# Altium schematic sheet SH2-CONTROLS.SchDoc: SH2-CONTROLS
size Letter; DrawnBy: Qinyang Bao; SheetNumber: 2; SheetTotal: 4
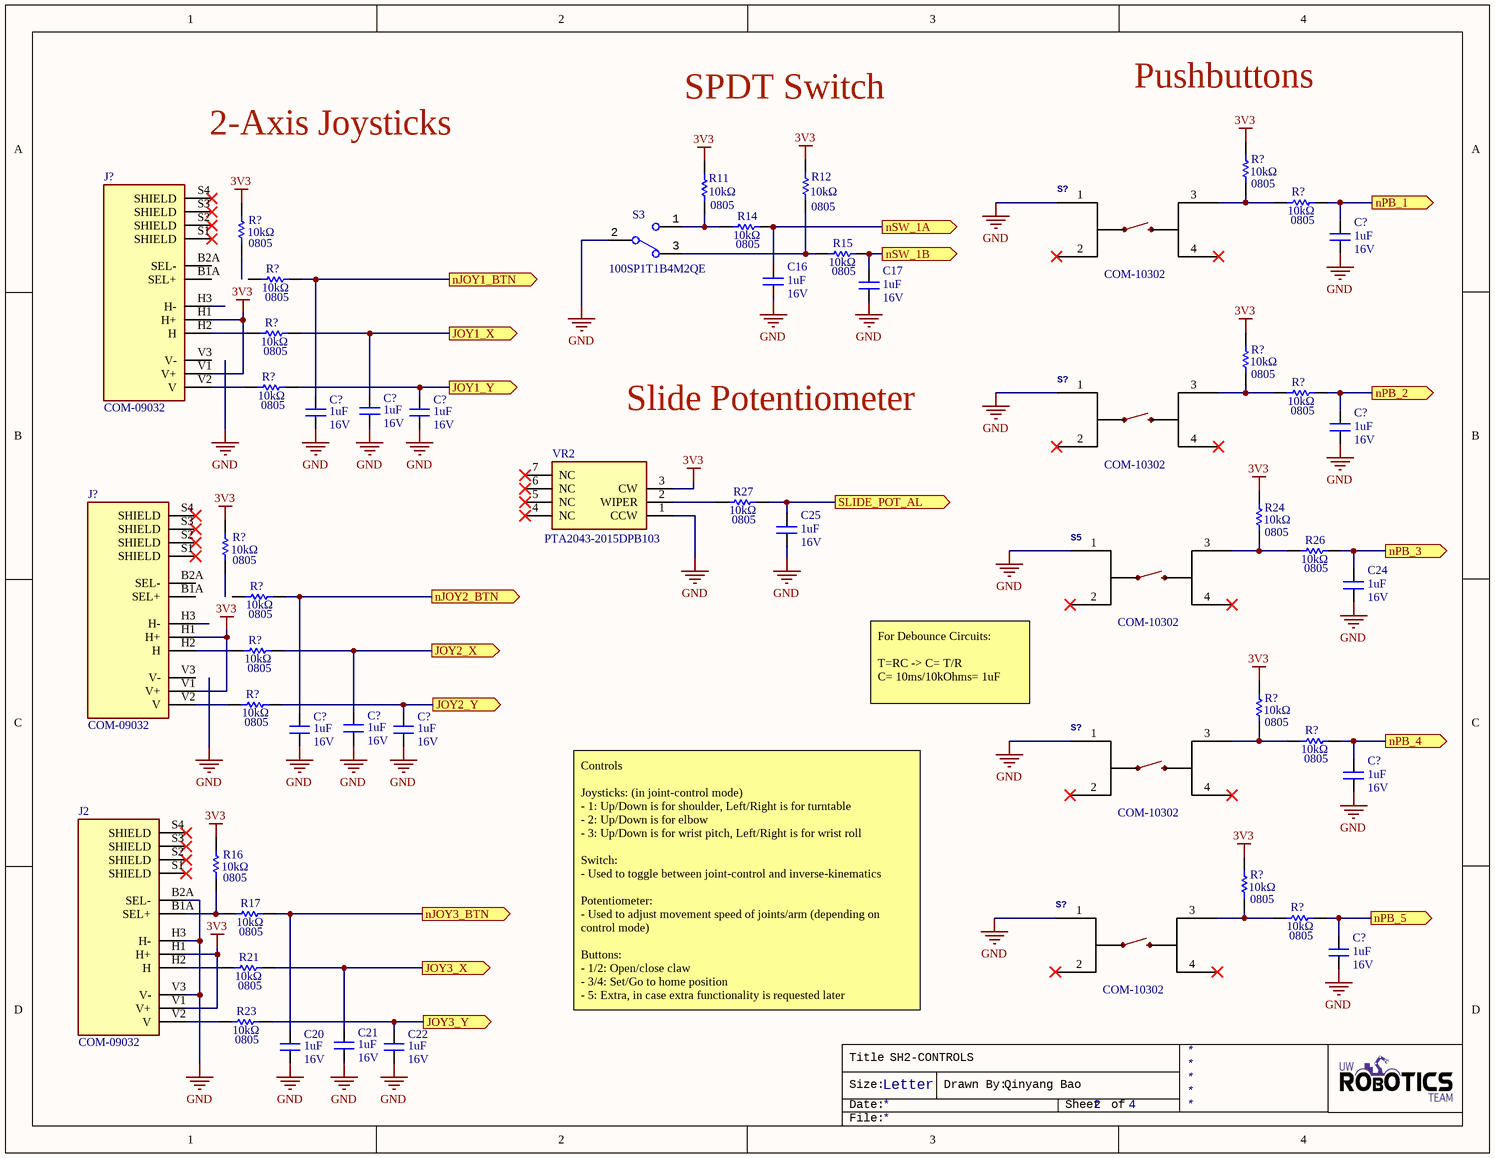
[diagram p0: SH2-CONTROLS.SchDoc]

## Parts
(Parts that share a designator on the sheet are numbered #1, #2 ... from top to bottom, then left to right.)
C16  value 1uF  Voltage Rating: 16V  [CAPC2012X140N]  (hidden comment: CAP_1uF_16V_0805)
C17  value 1uF  Voltage Rating: 16V  [CAPC2012X140N]  (hidden comment: CAP_1uF_16V_0805)
C20  value 1uF  Voltage Rating: 16V  [CAPC2012X140N]  (hidden comment: CAP_1uF_16V_0805)
C21  value 1uF  Voltage Rating: 16V  [CAPC2012X140N]  (hidden comment: CAP_1uF_16V_0805)
C22  value 1uF  Voltage Rating: 16V  [CAPC2012X140N]  (hidden comment: CAP_1uF_16V_0805)
C24  value 1uF  Voltage Rating: 16V  [CAPC2012X140N]  (hidden comment: CAP_1uF_16V_0805)
C25  value 1uF  Voltage Rating: 16V  [CAPC2012X140N]  (hidden comment: CAP_1uF_16V_0805)
C?#1  value 1uF  Voltage Rating: 16V  [CAPC2012X140N]  (hidden comment: CAP_1uF_16V_0805)
C?#2  value 1uF  Voltage Rating: 16V  [CAPC2012X140N]  (hidden comment: CAP_1uF_16V_0805)
C?#3  value 1uF  Voltage Rating: 16V  [CAPC2012X140N]  (hidden comment: CAP_1uF_16V_0805)
C?#4  value 1uF  Voltage Rating: 16V  [CAPC2012X140N]  (hidden comment: CAP_1uF_16V_0805)
C?#5  value 1uF  Voltage Rating: 16V  [CAPC2012X140N]  (hidden comment: CAP_1uF_16V_0805)
C?#6  value 1uF  Voltage Rating: 16V  [CAPC2012X140N]  (hidden comment: CAP_1uF_16V_0805)
C?#7  value 1uF  Voltage Rating: 16V  [CAPC2012X140N]  (hidden comment: CAP_1uF_16V_0805)
C?#8  value 1uF  Voltage Rating: 16V  [CAPC2012X140N]  (hidden comment: CAP_1uF_16V_0805)
C?#9  value 1uF  Voltage Rating: 16V  [CAPC2012X140N]  (hidden comment: CAP_1uF_16V_0805)
C?#10  value 1uF  Voltage Rating: 16V  [CAPC2012X140N]  (hidden comment: CAP_1uF_16V_0805)
J2  Manufacturer Part Number 1: COM-09032  [2_AXIS_JOY]  (hidden comment: 2_AXIS_JOYSTICK)
J?#1  Manufacturer Part Number 1: COM-09032  [2_AXIS_JOY]  (hidden comment: 2_AXIS_JOYSTICK)
J?#2  Manufacturer Part Number 1: COM-09032  [2_AXIS_JOY]  (hidden comment: 2_AXIS_JOYSTICK)
R11  value 10kΩ  Case Code (Imperial): 0805  [RESC2012X60N]  (hidden comment: RES_10kΩ_0805)
R12  value 10kΩ  Case Code (Imperial): 0805  [RESC2012X60N]  (hidden comment: RES_10kΩ_0805)
R14  value 10kΩ  Case Code (Imperial): 0805  [RESC2012X60N]  (hidden comment: RES_10kΩ_0805)
R15  value 10kΩ  Case Code (Imperial): 0805  [RESC2012X60N]  (hidden comment: RES_10kΩ_0805)
R16  value 10kΩ  Case Code (Imperial): 0805  [RESC2012X60N]  (hidden comment: RES_10kΩ_0805)
R17  value 10kΩ  Case Code (Imperial): 0805  [RESC2012X60N]  (hidden comment: RES_10kΩ_0805)
R21  value 10kΩ  Case Code (Imperial): 0805  [RESC2012X60N]  (hidden comment: RES_10kΩ_0805)
R23  value 10kΩ  Case Code (Imperial): 0805  [RESC2012X60N]  (hidden comment: RES_10kΩ_0805)
R24  value 10kΩ  Case Code (Imperial): 0805  [RESC2012X60N]  (hidden comment: RES_10kΩ_0805)
R26  value 10kΩ  Case Code (Imperial): 0805  [RESC2012X60N]  (hidden comment: RES_10kΩ_0805)
R27  value 10kΩ  Case Code (Imperial): 0805  [RESC2012X60N]  (hidden comment: RES_10kΩ_0805)
R?#1  value 10kΩ  Case Code (Imperial): 0805  [RESC2012X60N]  (hidden comment: RES_10kΩ_0805)
R?#2  value 10kΩ  Case Code (Imperial): 0805  [RESC2012X60N]  (hidden comment: RES_10kΩ_0805)
R?#3  value 10kΩ  Case Code (Imperial): 0805  [RESC2012X60N]  (hidden comment: RES_10kΩ_0805)
R?#4  value 10kΩ  Case Code (Imperial): 0805  [RESC2012X60N]  (hidden comment: RES_10kΩ_0805)
R?#5  value 10kΩ  Case Code (Imperial): 0805  [RESC2012X60N]  (hidden comment: RES_10kΩ_0805)
R?#6  value 10kΩ  Case Code (Imperial): 0805  [RESC2012X60N]  (hidden comment: RES_10kΩ_0805)
R?#7  value 10kΩ  Case Code (Imperial): 0805  [RESC2012X60N]  (hidden comment: RES_10kΩ_0805)
R?#8  value 10kΩ  Case Code (Imperial): 0805  [RESC2012X60N]  (hidden comment: RES_10kΩ_0805)
R?#9  value 10kΩ  Case Code (Imperial): 0805  [RESC2012X60N]  (hidden comment: RES_10kΩ_0805)
R?#10  value 10kΩ  Case Code (Imperial): 0805  [RESC2012X60N]  (hidden comment: RES_10kΩ_0805)
R?#11  value 10kΩ  Case Code (Imperial): 0805  [RESC2012X60N]  (hidden comment: RES_10kΩ_0805)
R?#12  value 10kΩ  Case Code (Imperial): 0805  [RESC2012X60N]  (hidden comment: RES_10kΩ_0805)
R?#13  value 10kΩ  Case Code (Imperial): 0805  [RESC2012X60N]  (hidden comment: RES_10kΩ_0805)
R?#14  value 10kΩ  Case Code (Imperial): 0805  [RESC2012X60N]  (hidden comment: RES_10kΩ_0805)
R?#15  value 10kΩ  Case Code (Imperial): 0805  [RESC2012X60N]  (hidden comment: RES_10kΩ_0805)
R?#16  value 10kΩ  Case Code (Imperial): 0805  [RESC2012X60N]  (hidden comment: RES_10kΩ_0805)
S3  SW_SPDT  [100SP1T1B4M2QE]  (value not drawn)
S5  Manufacturer Part Number 1: COM-10302  [TACTILE_SWITCH_PTH_12MM]  (hidden comment: Pushbutton)
S?#1  Manufacturer Part Number 1: COM-10302  [TACTILE_SWITCH_PTH_12MM]  (hidden comment: Pushbutton)
S?#2  Manufacturer Part Number 1: COM-10302  [TACTILE_SWITCH_PTH_12MM]  (hidden comment: Pushbutton)
S?#3  Manufacturer Part Number 1: COM-10302  [TACTILE_SWITCH_PTH_12MM]  (hidden comment: Pushbutton)
S?#4  Manufacturer Part Number 1: COM-10302  [TACTILE_SWITCH_PTH_12MM]  (hidden comment: Pushbutton)
VR2  Manufacturer Part Number 1: PTA2043-2015DPB103  [PTA20432015CPB103]  (hidden comment: POT_10K_SLIDE)

## Ports
JOY1_X (out), JOY1_Y (out), JOY2_X (out), JOY2_Y (out), JOY3_X (out), JOY3_Y (out), nJOY1_BTN (out), nJOY2_BTN (out), nJOY3_BTN (out), nPB_1 (out), nPB_2 (out), nPB_3 (out), nPB_4 (out), nPB_5 (out), nSW_1A (out), nSW_1B (out), SLIDE_POT_AL (out)

## Nets
3V3: J2.H1(H+) J2.V1(V+) J?#1.H1(H+) J?#1.V1(V+) J?#2.H1(H+) J?#2.V1(V+) R11.1 R12.1 R16.1 R24.1 R?#1.1 R?#3.1 R?#6.1 R?#9.1 R?#13.1 R?#15.1 VR2.3(CW)
GND: C16.1 C17.1 C20.1 C21.1 C22.1 C24.1 C25.1 C?#1.1 C?#2.1 C?#3.1 C?#4.1 C?#5.1 C?#6.1 C?#7.1 C?#8.1 C?#9.1 C?#10.1 J2.B2A(SEL-) J2.H3(H-) J2.V3(V-) S3.2 S5.1 S?#1.1 S?#2.1 S?#3.1 S?#4.1 VR2.1(CCW)
JOY1_X: C?#3.2 R?#5.2 ; port JOY1_X
JOY1_Y: C?#4.2 R?#7.2 ; port JOY1_Y
JOY2_X: C?#7.2 R?#11.2 ; port JOY2_X
JOY2_Y: C?#8.2 R?#12.2 ; port JOY2_Y
JOY3_X: C21.2 R21.2 ; port JOY3_X
JOY3_Y: C22.2 R23.2 ; port JOY3_Y
nJOY1_BTN: C?#2.2 R?#4.2 ; port nJOY1_BTN
nJOY2_BTN: C?#6.2 R?#10.2 ; port nJOY2_BTN
nJOY3_BTN: C20.2 R17.2 ; port nJOY3_BTN
nPB_1: C?#1.2 R?#2.2 ; port nPB_1
nPB_2: C?#5.2 R?#8.2 ; port nPB_2
nPB_3: C24.2 R26.2 ; port nPB_3
nPB_4: C?#9.2 R?#14.2 ; port nPB_4
nPB_5: C?#10.2 R?#16.2 ; port nPB_5
nSW_1A: C16.2 R14.2 ; port nSW_1A
nSW_1B: C17.2 R15.2 ; port nSW_1B
SLIDE_POT_AL: C25.2 R27.2 ; port SLIDE_POT_AL
NetJ2_B1A: J2.B1A(SEL+) R16.2 R17.1
NetJ2_H2: J2.H2(H) R21.1
NetJ2_V2: J2.V2(V) R23.1
NetJ?#1_H2: J?#1.H2(H) R?#5.1
NetJ?#1_V2: J?#1.V2(V) R?#7.1
NetJ?#2_H2: J?#2.H2(H) R?#11.1
NetJ?#2_V2: J?#2.V2(V) R?#12.1
NetR11_2: R11.2 R14.1 S3.1
NetR12_2: R12.2 R15.1 S3.3
NetR24_2: R24.2 R26.1 S5.3
NetR27_1: R27.1 VR2.2(WIPER)
NetR?#1_2: R?#1.2 R?#2.1 S?#1.3
NetR?#6_2: R?#6.2 R?#8.1 S?#2.3
NetR?#13_2: R?#13.2 R?#14.1 S?#3.3
NetR?#15_2: R?#15.2 R?#16.1 S?#4.3

Not connected (* = marked no-connect by the designer): J2 S1(SHIELD)* S2(SHIELD)* S3(SHIELD)* S4(SHIELD)*; J?#1 B1A(SEL+) B2A(SEL-) H3(H-) S1(SHIELD)* S2(SHIELD)* S3(SHIELD)* S4(SHIELD)* V3(V-); J?#2 B1A(SEL+) B2A(SEL-) H3(H-) S1(SHIELD)* S2(SHIELD)* S3(SHIELD)* S4(SHIELD)* V3(V-); R?#3 2; R?#4 1; R?#9 2; R?#10 1; S5 2* 4*; S?#1 2* 4*; S?#2 2* 4*; S?#3 2* 4*; S?#4 2* 4*; VR2 4(NC)* 5(NC)* 6(NC)* 7(NC)*

## Notes on the sheet
- Pushbuttons
- 2-Axis Joysticks
- SPDT Switch
- Slide Potentiometer
- For Debounce Circuits:
  T=RC -> C= T/R
  C= 10ms/10kOhms= 1uF
- Controls
  Joysticks: (in joint-control mode)
  - 1: Up/Down is for shoulder, Left/Right is for turntable
  - 2: Up/Down is for elbow
  - 3: Up/Down is for wrist pitch, Left/Right is for wrist roll
  Switch:
  - Used to toggle between joint-control and inverse-kinematics
  Potentiometer:
  - Used to adjust movement speed of joints/arm (depending on control mode)
  Buttons:
  - 1/2: Open/close claw
  - 3/4: Set/Go to home position
  - 5: Extra, in case extra functionality is requested later
- Title
- Size:
- Date:
- Letter
- Drawn By:
- Sheet
- of
- File:

## Library data of the parts
C16 C17 C20-C22 C24 C25 C?#1-C?#10 = CAP_1uF_16V_0805: CAP CER 1UF 16V X7R 0805; Manufacturer 1: Yageo; Manufacturer Part Number 1: CC0805KKX7R7BB105; Tolerance: 10%; Mount: Surface Mount; Case Code (Metric): 2012; Case Code (Imperial): 0805; Min Operating Temperature: -55°C; Max Operating Temperature: 125°C; Dielectric: X7R; Termination: SMD/SMT; Supplier 1: Digi-Key; Supplier Part Number 1: 311-1365-1-ND; Package: 0805 (2012 Metric)
J2 J?#1 J?#2 = 2_AXIS_JOYSTICK: JOYSTICK 10K OHM 2 AXIS TH; Manufacturer 1: SparkFun; Supplier 1: Digi-Key; Stock 1: 1039; Pricing 1: 1=3.95000 (USD); RoHS: No; ComponentLink1URL: https://media.digikey.com/pdf/Data%20Sheets/Sparkfun%20PDFs/COM-09032_Web.pdf?src-supplier=Digi-Key; ComponentLink1Description: https://media.digikey.com/pdf/Data%20Sheets/Sparkfun%20PDFs/COM-09032_Web.pdf?src-supplier=Digi-Key; Supplier Part Number 1: 1568-1526-ND
R11 R12 R14-R17 R21 R23 R24 R26 R27 R?#1-R?#16 = RES_10kΩ_0805: RES SMD 10K OHM 1% 1/8W 0805; Manufacturer 1: Yageo; Manufacturer Part Number 1: RC0805FR-0710KL; Power Rating: 125mW; Supplier 1: Digi-Key; Case Code (Metric): 2012; Min Operating Temperature: -55°C; Max Operating Temperature: 155°C; Resistance: 10K; Tolerance: 1%; Termination: SMD/SMT; Supplier Part Number 1: 311-10.0KCRCT-ND; Package: 0805 (2012 Metric)
S3 = SW_SPDT: SWITCH TOGGLE SPDT 5A 120V; Manufacturer 1: E-Switch; Actuator Material: Brass,Chrome; Switch Function: On-On; Voltage Rating (DC): 28V; Illumination Type: Non-Illuminated,Illuminated; Actuator Type: Standard Round; Electrical Life: 40000Cycles; Actuator Length: 12.19mm; ComponentLink1URL: https://datasheet.ciiva.com/24455/t111597-24455739.pdf?src-supplier=Onlinecomponents.com; ComponentLink1Description: https://datasheet.ciiva.com/24455/t111597-24455739.pdf?src-supplier=Onlinecomponents.com; ComponentLink2URL: https://datasheet.ciiva.com/2905/t111597-2905494.pdf?src-supplier=Digi-Key; ComponentLink2Description: https://datasheet.ciiva.com/2905/t111597-2905494.pdf?src-supplier=Digi-Key; Supplier 1: Digi-Key; Manufacturer Part Number 1: 100SP1T1B4M2QE; Stock 1: 4845; Pricing 1: 1=1.99000, 10=1.77900, 25=1.68240, 50=1.60200, 100=1.52950, 250=1.46512, 500=1.36850, 1000=1.30410 (USD); RoHS: Yes; Mount: Through Hole; Contact Material: Silver; Contact Plating: Silver; Min Operating Temperature: -30°C; Max Operating Temperature: 85°C; Package Quantity: 1; Current Rating: 5A; Voltage Rating (AC): 120V; Packaging: Bulk; Orientation: Vertical; Termination: PC Pin; Throw Configuration: SPDT; Lead Free: Lead Free; Supplier Part Number 1: EG2355-ND
S5 S?#1-S?#4 = MOMENTARY_SWITCH_TH: Momentary Switch (Pushbutton) - SPST; Manufacturer 1: SparkFun; SymbolName_1: SWITCH-MOMENTARY-2; PROD_ID: SWCH-09185; SF_SKU: COM-09190; Package: TACTILE_SWITCH_PTH_12MM; Supplier 1: Digi-Key; Stock 1: 32; Pricing 1: 1=5.85000 (USD); RoHS: No; Mount: Through Hole; Throw Configuration: SPST; Termination: PC Pin; ComponentLink1URL: https://www.sparkfun.com/datasheets/Components/Buttons/TSA12110%20TACT%20SWITCH.jpg?src-supplier=Digi-Key; ComponentLink1Description: https://www.sparkfun.com/datasheets/Components/Buttons/TSA12110%20TACT%20SWITCH.jpg?src-supplier=Digi-Key; Supplier Part Number 1: 1568-1332-ND
VR2 = POT_10K_SLIDE: SLIDE POT 10K OHM 0.1W TOP 20MM; Manufacturer 1: Bourns; Max Power Dissipation: 100mW; Tolerance: 20%; Resistance: 10kR; Power Rating: 50mW; Number of Turns: 1; Hole Diameter: 1.2mm; Supplier 1: Digi-Key; Stock 1: 927; Pricing 1: 1=1.29000, 10=1.14000, 25=1.02600, 50=0.98800, 100=0.95000, 250=0.89300, 500=0.76000, 1000=0.70300, 5000=0.57760 (USD); RoHS: Yes; Mount: Through Hole; Min Operating Temperature: -10°C; Max Operating Temperature: 50°C; Packaging: Bulk; Composition: Potentiometer; Type: Potentiometer; Termination: Pin; Taper: Linear; Military Standard: Not; Package Quantity: 100; Length: 35mm; Height: 0.256inch; Width: 0.354inch; Depth: 9mm; ComponentLink1URL: https://datasheet.ciiva.com/6248/pta-6248511.pdf?src-supplier=Digi-Key; ComponentLink1Description: https://datasheet.ciiva.com/6248/pta-6248511.pdf?src-supplier=Digi-Key; Supplier Part Number 1: PTA2043-2015DPB103-ND; Radiation Hardening: No